# Altium schematic sheet CLK_HMC7043.SchDoc: Sayma RTM
size 420 x 297 mm; Author: G.Kasprowicz; CompanyName: WUT ISE; DrawnBy: G.Kasprowicz; Organization: WUT ISE; Address1: PW ISE; Address2: Nowowiejska 15/19 00-665 Warsaw; Address3: gkasprow@gmail.com; DocumentNumber: 5; Revision: 1.0; SheetNumber: 5; SheetTotal: 18; ModifiedBy: -; CheckedDate: -; Title2: HMC7043 clock distribution; DivGrp: WUT ISE; Designer: G.Kasprowicz; ModifiedDate: -; ProjectName: Sensor Box
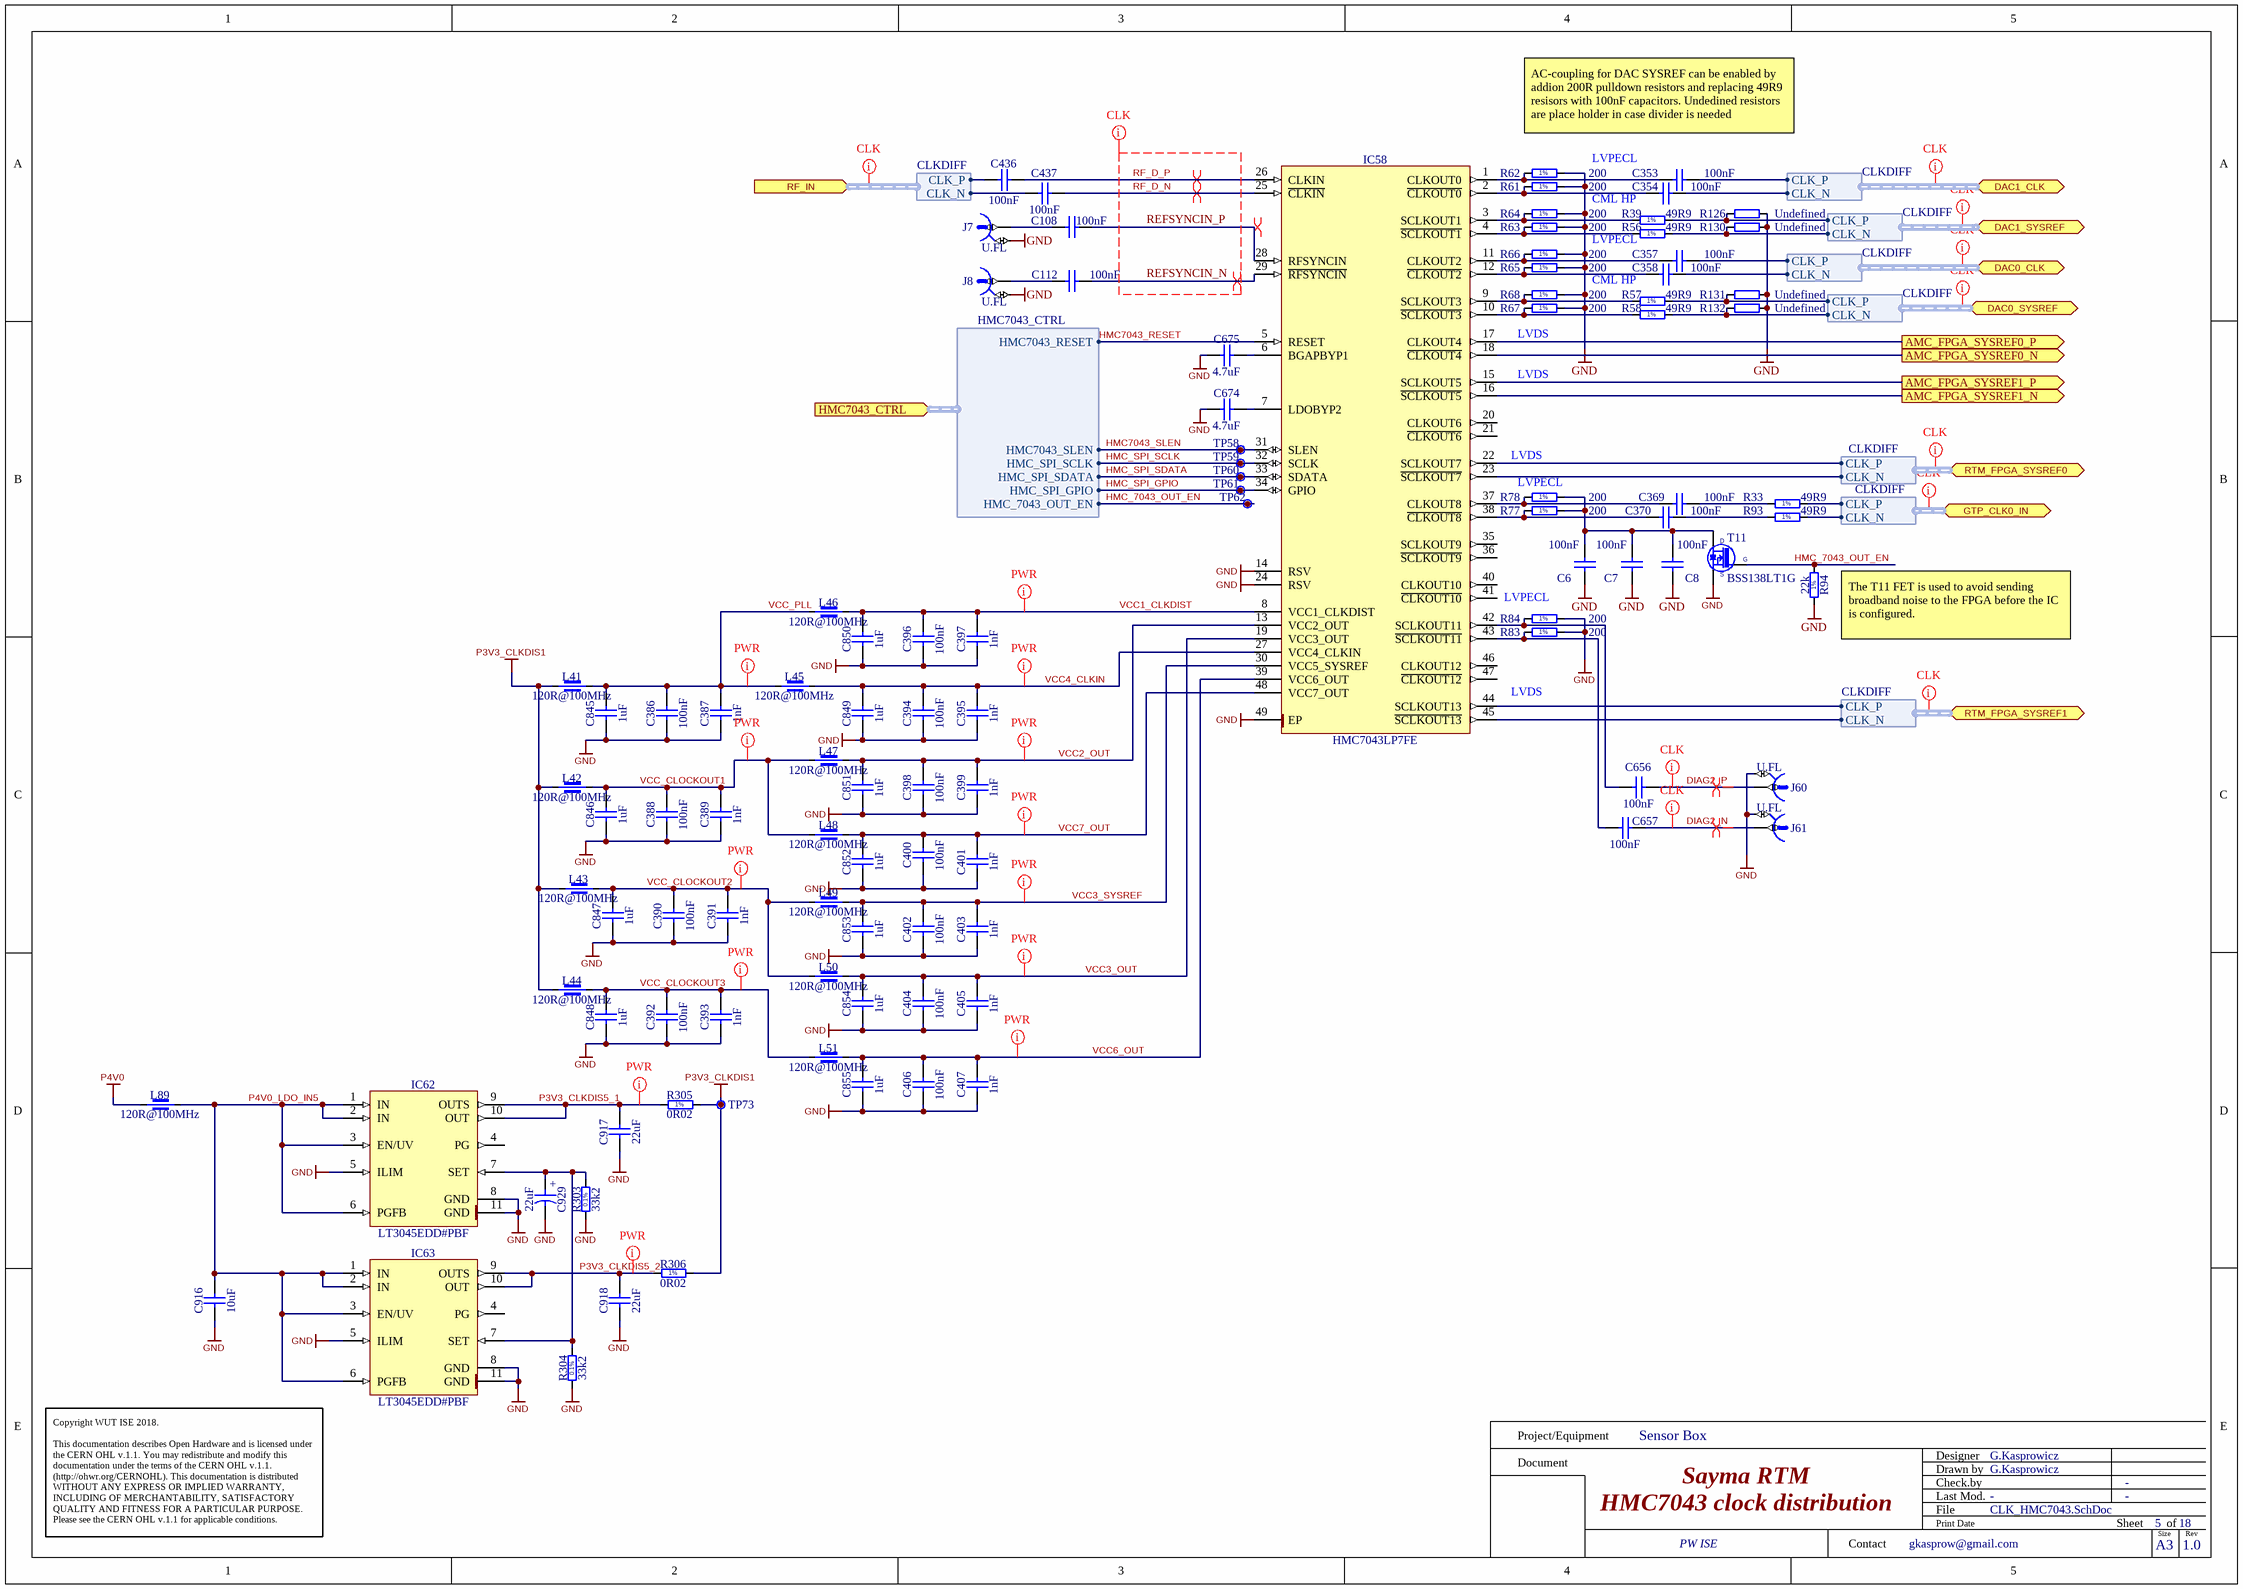
[diagram p0: CLK_HMC7043.SchDoc]

## Parts
C6  100nF  [CAPC0603X33N]
C7  100nF  [CAPC0603X33N]
C8  100nF  [CAPC0603X33N]
C108  100nF  [CAPC0603X33N]
C112  100nF  [CAPC0603X33N]
C353  100nF  [CAPC0603X33N]
C354  100nF  [CAPC0603X33N]
C357  100nF  [CAPC0603X33N]
C358  100nF  [CAPC0603X33N]
C369  100nF  [CAPC0603X33N]
C370  100nF  [CAPC0603X33N]
C386  100nF  [CAPC0603X33N]
C387  1nF  [CAPC0603X33N]
C388  100nF  [CAPC0603X33N]
C389  1nF  [CAPC0603X33N]
C390  100nF  [CAPC0603X33N]
C391  1nF  [CAPC0603X33N]
C392  100nF  [CAPC0603X33N]
C393  1nF  [CAPC0603X33N]
C394  100nF  [CAPC0603X33N]
C395  1nF  [CAPC0603X33N]
C396  100nF  [CAPC0603X33N]
C397  1nF  [CAPC0603X33N]
C398  100nF  [CAPC0603X33N]
C399  1nF  [CAPC0603X33N]
C400  100nF  [CAPC0603X33N]
C401  1nF  [CAPC0603X33N]
C402  100nF  [CAPC0603X33N]
C403  1nF  [CAPC0603X33N]
C404  100nF  [CAPC0603X33N]
C405  1nF  [CAPC0603X33N]
C406  100nF  [CAPC0603X33N]
C407  1nF  [CAPC0603X33N]
C436  100nF  [CAPC0603X33N]
C437  100nF  [CAPC0603X33N]
C656  100nF  [CAPC0603X33N]
C657  100nF  [CAPC0603X33N]
C674  4.7uF  [CAPC1608X90N]
C675  4.7uF  [CAPC1608X90N]
C845  1uF  [CAPC1005X55N]
C846  1uF  [CAPC1005X55N]
C847  1uF  [CAPC1005X55N]
C848  1uF  [CAPC1005X55N]
C849  1uF  [CAPC1005X55N]
C850  1uF  [CAPC1005X55N]
C851  1uF  [CAPC1005X55N]
C852  1uF  [CAPC1005X55N]
C853  1uF  [CAPC1005X55N]
C854  1uF  [CAPC1005X55N]
C855  1uF  [CAPC1005X55N]
C916  10uF  [CAPC1608X87N]
C917  22uF  [CAPC2012X135N]
C918  22uF  [CAPC2012X135N]
C929  22uF  [CAPMP3216X180N]
IC58  HMC7043LP7FE  [QFN50P700X700X100-49N-S565]
IC62  LT3045EDD#PBF  [SON50P300X300X80-11N-R175X248]
IC63  LT3045EDD#PBF  [SON50P300X300X80-11N-R175X248]
J7  U.FL  [HIROSE_U.FL-R-SMT-1(10)]
J8  U.FL  [HIROSE_U.FL-R-SMT-1(10)]
J60  U.FL  [HIROSE_U.FL-R-SMT-1(10)]
J61  U.FL  [HIROSE_U.FL-R-SMT-1(10)]
L41  120R@100MHz  [INDC1608X95N]
L42  120R@100MHz  [INDC1608X95N]
L43  120R@100MHz  [INDC1608X95N]
L44  120R@100MHz  [INDC1608X95N]
L45  120R@100MHz  [INDC1608X95N]
L46  120R@100MHz  [INDC1608X95N]
L47  120R@100MHz  [INDC1608X95N]
L48  120R@100MHz  [INDC1608X95N]
L49  120R@100MHz  [INDC1608X95N]
L50  120R@100MHz  [INDC1608X95N]
L51  120R@100MHz  [INDC1608X95N]
L89  120R@100MHz  [INDC1608X95N]
R33  49R9  [RESC1005X40N]
R39  49R9  [RESC1005X40N]
R56  49R9  [RESC1005X40N]
R57  49R9  [RESC1005X40N]
R58  49R9  [RESC1005X40N]
R61  200  [RESC1005X40N]
R62  200  [RESC1005X40N]
R63  200  [RESC1005X40N]
R64  200  [RESC1005X40N]
R65  200  [RESC1005X40N]
R66  200  [RESC1005X40N]
R67  200  [RESC1005X40N]
R68  200  [RESC1005X40N]
R77  200  [RESC1005X40N]
R78  200  [RESC1005X40N]
R83  200  [RESC1005X40N]
R84  200  [RESC1005X40N]
R93  49R9  [RESC1005X40N]
R94  22k  [RESC1005X40N]
R126  Undefined  [RESC1005X40N]
R130  Undefined  [RESC1005X40N]
R131  Undefined  [RESC1005X40N]
R132  Undefined  [RESC1005X40N]
R303  33k2  [RESC1608X55N]
R304  33k2  [RESC1608X55N]
R305  0R02  [RESC3216X80N]
R306  0R02  [RESC3216X80N]
T11  BSS138LT1G  [SOT95P240X110-3N]
TP58  Test Point  [TPS127]  (value not drawn)
TP59  Test Point  [TPS127]  (value not drawn)
TP60  Test Point  [TPS127]  (value not drawn)
TP61  Test Point  [TPS127]  (value not drawn)
TP62  Test Point  [TPS127]  (value not drawn)
TP73  Test Point  [TPS127]  (value not drawn)

## Ports
AMC_FPGA_SYSREF0_N (out), AMC_FPGA_SYSREF0_P (out), AMC_FPGA_SYSREF1_N (out), AMC_FPGA_SYSREF1_P (out), DAC0_CLK (bidir, harness CLKDIFF), DAC0_SYSREF (bidir, harness CLKDIFF), DAC1_CLK (bidir, harness CLKDIFF), DAC1_SYSREF (bidir, harness CLKDIFF), GTP_CLK0_IN (bidir, harness CLKDIFF), HMC7043_CTRL (in, harness HMC7043_CTRL), RF_IN (in, harness CLKDIFF), RTM_FPGA_SYSREF0 (bidir, harness CLKDIFF), RTM_FPGA_SYSREF1 (bidir, harness CLKDIFF)

## Harnesses
HMC7043_CTRL: HMC7043_RESET, HMC_SPI_SDATA, HMC7043_SLEN, HMC_SPI_SCLK, HMC_SPI_GPIO, HMC_7043_OUT_EN
CLKDIFF: CLK_P, CLK_N
CLKDIFF: CLK_N, CLK_P

## Nets
GND: C6.1 C7.1 C8.1 C386.1 C387.1 C388.1 C389.1 C390.1 C391.1 C392.1 C393.1 C394.1 C395.1 C396.1 C397.1 C398.1 C399.1 C400.1 C401.1 C402.1 C403.1 C404.1 C405.1 C406.1 C407.1 C674.1 C675.1 C845.2 C846.2 C847.2 C848.2 C849.2 C850.2 C851.2 C852.2 C853.2 C854.2 C855.2 C916.1 C917.1 C918.1 C929.2 IC58.14(RSV) IC58.24(RSV) IC58.49(EP) IC62.5(ILIM) IC62.8(GND) IC62.11(GND) IC63.5(ILIM) IC63.8(GND) IC63.11(GND) J7.2 J8.2 J60.2 J61.2 R61.2 R62.2 R63.2 R64.2 R65.2 R66.2 R67.2 R68.2 R83.2 R84.2 R94.1 R126.2 R130.2 R131.2 R132.2 R303.1 R304.1 T11.2(S)
P3V3_CLKDIS1: L41.1 L42.1 L43.1 L44.1 R305.2 R306.2 TP73.1
P4V0: L89.1
AMC_FPGA_SYSREF0_N: IC58.18(~{CLKOUT4}) ; port AMC_FPGA_SYSREF0_N
AMC_FPGA_SYSREF0_P: IC58.17(CLKOUT4) ; port AMC_FPGA_SYSREF0_P
AMC_FPGA_SYSREF1_N: IC58.16(~{SCLKOUT5}) ; port AMC_FPGA_SYSREF1_N
AMC_FPGA_SYSREF1_P: IC58.15(SCLKOUT5) ; port AMC_FPGA_SYSREF1_P
DIAG2_N: C657.2 J61.1
DIAG2_P: C656.2 J60.1
HMC7043_RESET: IC58.5(RESET) ; port HMC7043_CTRL.HMC7043_RESET
HMC7043_SLEN: IC58.31(SLEN) TP58.1 ; port HMC7043_CTRL.HMC7043_SLEN
HMC_7043_OUT_EN: R94.2 T11.1(G) TP62.1 ; port HMC7043_CTRL.HMC_7043_OUT_EN
HMC_SPI_GPIO: IC58.34(GPIO) TP61.1 ; port HMC7043_CTRL.HMC_SPI_GPIO
HMC_SPI_SCLK: IC58.32(SCLK) TP59.1 ; port HMC7043_CTRL.HMC_SPI_SCLK
HMC_SPI_SDATA: IC58.33(SDATA) TP60.1 ; port HMC7043_CTRL.HMC_SPI_SDATA
P3V3_CLKDIS5_1: C917.2 IC62.9(OUTS) IC62.10(OUT) R305.1
P3V3_CLKDIS5_2: C918.2 IC63.9(OUTS) IC63.10(OUT) R306.1
P4V0_LDO_IN5: C916.2 IC62.1(IN) IC62.2(IN) IC62.3(EN/UV) IC62.6(PGFB) IC63.1(IN) IC63.2(IN) IC63.3(EN/UV) IC63.6(PGFB) L89.2
REFSYNCIN_N: C112.2 IC58.29(~{RFSYNCIN})
REFSYNCIN_P: C108.2 IC58.28(RFSYNCIN)
RF_D_N: C437.2 IC58.25(~{CLKIN})
RF_D_P: C436.2 IC58.26(CLKIN)
VCC1_CLKDIST: C396.2 C397.2 C850.1 IC58.8(VCC1_CLKDIST) L46.2
VCC2_OUT: C398.2 C399.2 C851.1 IC58.13(VCC2_OUT) L47.2
VCC3_OUT: C404.2 C405.2 C854.1 IC58.19(VCC3_OUT) L50.2
VCC3_SYSREF: C402.2 C403.2 C853.1 IC58.30(VCC5_SYSREF) L49.2
VCC4_CLKIN: C394.2 C395.2 C849.1 IC58.27(VCC4_CLKIN) L45.2
VCC6_OUT: C406.2 C407.2 C855.1 IC58.39(VCC6_OUT) L51.2
VCC7_OUT: C400.2 C401.2 C852.1 IC58.48(VCC7_OUT) L48.2
VCC_CLOCKOUT1: C388.2 C389.2 C846.1 L42.2 L47.1 L48.1
VCC_CLOCKOUT2: C390.2 C391.2 C847.1 L43.2 L49.1 L50.1
VCC_CLOCKOUT3: C392.2 C393.2 C848.1 L44.2 L51.1
VCC_PLL: C386.2 C387.2 C845.1 L41.2 L45.1 L46.1
NetC6_2: C6.2 C7.2 C8.2 R77.2 R78.2 T11.3(D)
NetC108_1: C108.1 J7.1
NetC112_1: C112.1 J8.1
NetC353_1: C353.1 IC58.1(CLKOUT0) R62.1
NetC353_2: C353.2 ; port DAC1_CLK.CLK_P
NetC354_1: C354.1 IC58.2(~{CLKOUT0}) R61.1
NetC354_2: C354.2 ; port DAC1_CLK.CLK_N
NetC357_1: C357.1 IC58.11(CLKOUT2) R66.1
NetC357_2: C357.2 ; port DAC0_CLK.CLK_P
NetC358_1: C358.1 IC58.12(~{CLKOUT2}) R65.1
NetC358_2: C358.2 ; port DAC0_CLK.CLK_N
NetC369_1: C369.1 IC58.37(CLKOUT8) R78.1
NetC369_2: C369.2 R33.1
NetC370_1: C370.1 IC58.38(~{CLKOUT8}) R77.1
NetC370_2: C370.2 R93.1
NetC436_1: C436.1 ; port RF_IN.CLK_P
NetC437_1: C437.1 ; port RF_IN.CLK_N
NetC656_1: C656.1 IC58.42(SCLKOUT11) R84.1
NetC657_1: C657.1 IC58.43(~{SCLKOUT11}) R83.1
NetC674_2: C674.2 IC58.7(LDOBYP2)
NetC675_2: C675.2 IC58.6(BGAPBYP1)
NetC929_1: C929.1 IC62.7(SET) IC63.7(SET) R303.2 R304.2
NetIC58_3: IC58.3(SCLKOUT1) R39.1 R64.1
NetIC58_4: IC58.4(~{SCLKOUT1}) R56.1 R63.1
NetIC58_9: IC58.9(SCLKOUT3) R57.1 R68.1
NetIC58_10: IC58.10(~{SCLKOUT3}) R58.1 R67.1
NetIC58_22: IC58.22(SCLKOUT7) ; port RTM_FPGA_SYSREF0.CLK_P
NetIC58_23: IC58.23(~{SCLKOUT7}) ; port RTM_FPGA_SYSREF0.CLK_N
NetIC58_44: IC58.44(SCLKOUT13) ; port RTM_FPGA_SYSREF1.CLK_P
NetIC58_45: IC58.45(~{SCLKOUT13}) ; port RTM_FPGA_SYSREF1.CLK_N
NetR33_2: R33.2 ; port GTP_CLK0_IN.CLK_P
NetR39_2: R39.2 R126.1 ; port DAC1_SYSREF.CLK_P
NetR56_2: R56.2 R130.1 ; port DAC1_SYSREF.CLK_N
NetR57_2: R57.2 R131.1 ; port DAC0_SYSREF.CLK_P
NetR58_2: R58.2 R132.1 ; port DAC0_SYSREF.CLK_N
NetR93_2: R93.2 ; port GTP_CLK0_IN.CLK_N

Not connected (* = marked no-connect by the designer): IC58 20(CLKOUT6) 21(~{CLKOUT6}) 35(SCLKOUT9) 36(~{SCLKOUT9}) 40(CLKOUT10) 41(~{CLKOUT10}) 46(CLKOUT12) 47(~{CLKOUT12}); IC62 4(PG); IC63 4(PG)

## Layout directives
net class CLK: (no net found under the mark), DIAG2_N, DIAG2_P, REFSYNCIN_N, REFSYNCIN_P, RF_D_N, RF_D_P
differential pair: DIAG2_N, DIAG2_P, REFSYNCIN_N, REFSYNCIN_P, RF_D_N, RF_D_P
net class PWR: P3V3_CLKDIS5_1, P3V3_CLKDIS5_2, VCC1_CLKDIST, VCC2_OUT, VCC3_OUT, VCC3_SYSREF, VCC4_CLKIN, VCC6_OUT, VCC7_OUT, VCC_CLOCKOUT1, VCC_CLOCKOUT2, VCC_CLOCKOUT3, VCC_PLL

## Notes on the sheet
- AC-coupling for DAC SYSREF can be enabled by addion 200R pulldown resistors and replacing 49R9 resisors with 100nF capacitors. Undedined resistors are place holder in case divider is needed
- LVPECL
- CML HP
- LVDS
- (near R78) LVPECL
- (near R84) LVPECL
- (near R94) The T11 FET is used to avoid sending broadband noise to the FPGA before the IC is configured.
- Project/Equipment
- Document
- Designer
- Drawn by
- Check.by
- Copyright WUT ISE 2018.
  This documentation describes Open Hardware and is licensed under the CERN OHL v.1.1. You may redistribute and modify this documentation under the terms of the CERN OHL v.1.1. (http://ohwr.org/CERNOHL). This documentation is distributed WITHOUT ANY EXPRESS OR IMPLIED WARRANTY, INCLUDING OF MERCHANTABILITY, SATISFACTORY QUALITY AND FITNESS FOR A PARTICULAR PURPOSE. Please see the CERN OHL v.1.1 for applicable conditions.
- Contact
- File
- Last Mod.
- Print Date
- Sheet
- Size
- A3
- of
- Rev
- (in symbol CTE3216-18_22UF_6.3V_10%_LESR0900) +
- (in symbol R0402_22K_1%_0.0625W_100PPM) 1%
- (in symbol R0402_49R9_1%_0.0625W_100PPM) 1%
- (in symbol R0402_200R_1%_0.0625W_100PPM) 1%
- (in symbol R0603_33K2_0.1%_0.063W_10PPM) 0.1%
- (in symbol R1206_0R02_1%_0.5W_100PPM) 1%

## Library data of the parts
C6-C8 C108 C112 C353 C354 C357 C358 C369 C370 C386 C388 C390 C392 C394 C396 C398 C400 C402 C404 C406 C436 C437 C656 C657 = CC0201_100NF_6.3V_10%_X5R: Non-polarised capacitor; Manufacturer: GENERIC; Part Description: SMD Multilayer Chip Ceramic Capacitor; Manufacturer1 Part Number: 02016D104KAT2A; Tolerance: ±10%; Voltage: 6.3V; TC: X5R; Manufacturer Part Number: CC0201_100NF_6.3V_10%_X5R; Part Number: CC0201_100NF_6.3V_10%_X5R; Component Kind: Standard; Component Type: Standard; Pin Count: 2; Value: 100nF; Status: Not Recommended; Case: 0201; Mounted: Yes; Socket: No; SMD: Yes; Sense: No; Manufacturer1 Example: AVX; Manufacturer1 ComponentHeight: 0.33mm; HelpURL: \\cern.ch\dfs\Applications\Altium\Datasheets\CC0201_X5R_AVX.pdf; Author: CERN DEM JLC; CreateDate: 03.12.2007; LatestRevisionDate: 03.12.2007
C387 C389 C391 C393 C395 C397 C399 C401 C403 C405 C407 = CC0201_1NF_16V_10%_X5R: Non-polarised capacitor; Manufacturer: GENERIC; Part Description: SMD Multilayer Chip Ceramic Capacitor; Manufacturer1 Part Number: 0201YD102KAT2A; Tolerance: ±10%; Voltage: 16V; TC: X5R; Manufacturer Part Number: CC0201_1NF_16V_10%_X5R; Part Number: CC0201_1NF_16V_10%_X5R; Value: 1nF; Component Kind: Standard; Component Type: Standard; Pin Count: 2; Status: Not Recommended; Case: 0201; Mounted: Yes; Socket: No; SMD: Yes; Sense: No; Manufacturer1 Example: AVX; Manufacturer1 ComponentHeight: 0.33mm; HelpURL: \\cern.ch\dfs\Applications\Altium\Datasheets\CC0201_X5R_AVX.pdf; Author: CERN DEM JLC; CreateDate: 03.12.2007; LatestRevisionDate: 03.12.2007
C674 C675 = CC0603_4.7UF_25V_10%_X5R: Non-polarised capacitor; Manufacturer: GENERIC; Part Description: SMD Multilayer Chip Ceramic Capacitor; Manufacturer1 Part Number: GRM188R61E475KE11D; Tolerance: ±10%; Voltage: 25V; TC: X5R; Manufacturer Part Number: CC0603_4.7UF_25V_10%_X5R; Part Number: CC0603_4.7UF_25V_10%_X5R; Value: 4.7uF; Component Kind: Standard; Component Type: Standard; Pin Count: 2; Status: None; Case: 0603; Mounted: Yes; Socket: No; SMD: Yes; Sense: No; Manufacturer1 Example: MURATA; Manufacturer1 ComponentHeight: 0.95mm; HelpURL: \\cern.ch\dfs\Applications\Altium\Datasheets\CC0603_MURATA_GRM188R61E475KE11D.pdf; Author: CERN DEM JLC; CreateDate: 10.11.2014; LatestRevisionDate: 10.11.2014
C845-C855 = CC0402_1UF_16V_10%_X5R: Non-polarised capacitor; Manufacturer: GENERIC; Part Description: SMD Multilayer Chip Ceramic Capacitor; Manufacturer1 Part Number: C1005X5R1C105KT; Tolerance: ±10%; Voltage: 16V; TC: X5R; Manufacturer Part Number: CC0402_1UF_16V_10%_X5R; Part Number: CC0402_1UF_16V_10%_X5R; Value: 1uF; Component Kind: Standard; Component Type: Standard; Pin Count: 2; Status: Preferred; Case: 0402; Mounted: Yes; Socket: No; SMD: Yes; Sense: No; Manufacturer1 Example: TDK; Manufacturer1 ComponentHeight: 0.55mm; HelpURL: \\cern.ch\dfs\Applications\Altium\Datasheets\CC0402_X5R_TDK_C.pdf; Author: CERN DEM JLC; CreateDate: 25.10.2012; LatestRevisionDate: 25.10.2012
C916 = CC0603_10uF_6.3V_20%_X5R: Non-polarised capacitor; Manufacturer: GENERIC; Part Description: SMD Multilayer Chip Ceramic Capacitor; Manufacturer1 Part Number: C0603C106M9PAC; Tolerance: ±20%; Voltage: 6.3V; TC: X5R; Manufacturer Part Number: CC0603_10uF_6.3V_20%_X5R; Part Number: CC0603_10UF_6.3V_20%_X5R; Value: 10uF; Component Kind: Standard; Component Type: Standard; Pin Count: 2; Status: Preferred; Case: 0603; Mounted: Yes; Socket: No; SMD: Yes; Sense: No; Manufacturer1 Example: KEMET; Manufacturer1 ComponentHeight: 0.95mm; HelpURL: \\cern.ch\dfs\Applications\Altium\Datasheets\CC0603_X5R_KEMET.pdf; Author: CERN DEM JLC; CreateDate: 03.12.2007; LatestRevisionDate: 03.12.2007
C917 C918 = CC0805_22UF_16V_10%_X5R: Non-polarised capacitor; Manufacturer: GENERIC; Part Description: SMD Multilayer Chip Ceramic Capacitor; Manufacturer1 Part Number: C2012X5R1C226KT; Tolerance: ±10%; Voltage: 16V; TC: X5R; Manufacturer Part Number: CC0805_22UF_16V_10%_X5R; Part Number: CC0805_22UF_16V_10%_X5R; Value: 22uF; Component Kind: Standard; Component Type: Standard; Pin Count: 2; Status: Preferred; Case: 0805; Mounted: Yes; Socket: No; SMD: Yes; Sense: No; Manufacturer1 Example: TDK; Manufacturer1 ComponentHeight: 1.35mm; HelpURL: \\cern.ch\dfs\Applications\Altium\Datasheets\CC0805_X5R_TDK_C.pdf; Author: CERN DEM JLC; CreateDate: 25.10.2012; LatestRevisionDate: 25.10.2012
C929 = CTE3216-18_22UF_6.3V_10%_LESR0900: Polarised capacitor; Manufacturer: GENERIC; Part Description: Low ESR 0R9 Solid Tantalum Chip Capacitor; Manufacturer1 Part Number: TPSA226K006R0900; Tolerance: ±10%; Voltage: 6.3V; Manufacturer Part Number: CTE3216-18_22UF_6.3V_10%_LESR0900; Part Number: CTE3216-18_22UF_6.3V_10%_LESR0900; Value: 22uF; Component Kind: Standard; Component Type: Standard; Pin Count: 2; Status: Preferred; Case: A; Mounted: Yes; Socket: No; SMD: Yes; Sense: No; Manufacturer1 Example: AVX; Manufacturer1 ComponentHeight: 1.8mm; HelpURL: \\cern.ch\dfs\Applications\Altium\Datasheets\CTE-LESR_AVX_TPS.pdf; Author: CERN DEM JLC; CreateDate: 05.05.2008; LatestRevisionDate: 20.01.2009
IC58 = HMC7043LP7FE: High Performance, 3.2 GHz, 14-Output Fanout Buffer; Manufacturer: ANALOG DEVICES; PressFit: No; Bonding: No; Manufacturer Part Number: HMC7043LP7FE; PackageDescription: QFN, 0.50mm Pitch, Square; 48 Pin, 7.00mm L X 7.00mm W X 1.00mm H Body (w/thermal Tab 5.65mm X 5.65mm), IPC Medium Density; Part Description: High Performance, 3.2GHz, 14-Output Fanout Buffer; Part Number: HMC7043LP7FE; Component Kind: Standard; Component Type: Standard; Device: HMC7043LP7FE; Pin Count: 49; Case: QFN48; Mounted: Yes; Socket: No; SMD: Yes; Sense: No; ComponentHeight: 0.9mm; Author: CERN DEM BC; HelpURL: \\cern.ch\dfs\Applications\Altium\Datasheets\HMC7043LP7FE.pdf; CreateDate: 15.08.2016; LatestRevisionDate: 15.08.2016
IC62 IC63 = LT3045EDD#PBF: 20V, 500mA, Ultralow Noise, Ultrahigh PSRR Linear Regulator; Manufacturer: LINEAR TECHNOLOGY; PressFit: No; Bonding: No; Manufacturer Part Number: LT3045EDD#PBF; PackageDescription: SON, 0.50mm Pitch, 10-pin, 3.00mm W  X 3.00mm L X 0.80mm Height, (w/thermal tab 1.75 X 2.48 mm), IPC Medium Density; Part Description: 20V, 500mA, Ultralow Noise, Ultrahigh PSRR Linear Regulator; Part Number: LT3045EDD#PBF; Component Kind: Standard; Component Type: Standard; Device: LT3045EDD#PBF; Pin Count: 11; Case: SON10; Mounted: Yes; Socket: No; SMD: Yes; Sense: No; ComponentHeight: 0.8mm; HelpURL: \\cern.ch\dfs\Applications\Altium\Datasheets\LT3045EDD#PBF.pdf; Author: CERN DEM JLC; CreateDate: 07.12.2016; LatestRevisionDate: 07.12.2016
J7 J8 J60 J61 = HIROSE_U.FL-R-SMT-1(10): Manufacturer: HIROSE (HRS); Part Description: Up to 6GHz Ultra Small Surface Mount Male Coaxial Connectors U.FL Series; PressFit: No; Manufacturer Part Number: U.FL-R-SMT-1(10); Part Number: HIROSE_U.FL-R-SMT-1(10); Component Kind: Standard; Component Type: Standard; Pin Count: 2; Family: U.FL; Mounted: Yes; Socket: No; SMD: Yes; Sense: No; Status: None; ComponentHeight: 1.25mm; HelpURL: \\cern.ch\dfs\Applications\Altium\Datasheets\HIROSE_U.FL-R-SMT-1(10).pdf; Author: CERN DEM JLC; CreateDate: 24.03.2010; LatestRevisionDate: 24.03.2010
L41-L51 L89 = IND0603_MURATA_BLM18PG121SN1D: Manufacturer: MURATA; Part Description: SMD EMIFIL Chip Ferrite Bead; Power: 2A; Resistance: 0.05R; Manufacturer Part Number: BLM18PG121SN1D; Part Number: IND0603_MURATA_BLM18PG121SN1D; Value: 120R@100MHz; Component Kind: Standard; Component Type: Standard; Pin Count: 2; Status: None; Case: 0603; Mounted: Yes; Socket: No; SMD: Yes; Sense: No; ComponentHeight: 0.95mm; HelpURL: \\cern.ch\dfs\Applications\Altium\Datasheets\IND0603_MURATA_BLM18P.pdf; Author: CERN DEM BC; CreateDate: 27.07.2015; LatestRevisionDate: 25.10.2018
R33 R39 R56-R58 R93 = R0402_49R9_1%_0.0625W_100PPM: Resistor - 1%; Manufacturer: GENERIC; Manufacturer1 Part Number: 232270674999L or RC0402FR-0749R9L; Part Description: General Purpose Thick Film Chip Resistor; TC: ±100ppm/°C; PressFit: No; Case: 0402; Manufacturer Part Number: R0402_49R9_1%_0.0625W_100PPM; Manufacturer1 ComponentHeight: 0.4mm; Manufacturer1 Example: YAGEO PHYCOMP; Part Number: R0402_49R9_1%_0.0625W_100PPM; Pin Count: 2; Power: 0.0625W; Sense: No; SMD: Yes; Status: Not Recommended; Tolerance: ±1%; Value: 49R9; Component Kind: Standard; Component Type: Standard; Mounted: Yes; Socket: No; HelpURL: \\cern.ch\dfs\Applications\Altium\Datasheets\R0402_Phycomp_RC0402.pdf; Author: CERN DEM JLC; CreateDate: 24.10.2012; LatestRevisionDate: 24.10.2012
R61-R68 R77 R78 R83 R84 = R0402_200R_1%_0.0625W_100PPM: Resistor - 1%; Manufacturer: GENERIC; Part Description: General Purpose Thick Film Chip Resistor; Manufacturer1 Part Number: 232270672001L; TC: ±100ppm/°C; PressFit: No; Manufacturer Part Number: R0402_200R_1%_0.0625W_100PPM; Part Number: R0402_200R_1%_0.0625W_100PPM; Tolerance: ±1%; Value: 200; Component Kind: Standard; Component Type: Standard; Pin Count: 2; Status: Not Recommended; Power: 0.0625W; Case: 0402; Mounted: Yes; Sense: No; Socket: No; SMD: Yes; Manufacturer1 Example: YAGEO PHYCOMP; Manufacturer1 ComponentHeight: 0.4mm; HelpURL: \\cern.ch\dfs\Applications\Altium\Datasheets\R0402_Phycomp_RC0402.pdf; Author: CERN DEM JLC; CreateDate: 03.12.2007; LatestRevisionDate: 17.10.2012
R94 = R0402_22K_1%_0.0625W_100PPM: Resistor - 1%; Manufacturer: GENERIC; Manufacturer1 Part Number: 232270672203L; Part Description: General Purpose Thick Film Chip Resistor; TC: ±100ppm/°C; PressFit: No; Case: 0402; Manufacturer Part Number: R0402_22K_1%_0.0625W_100PPM; Manufacturer1 ComponentHeight: 0.4mm; Manufacturer1 Example: YAGEO PHYCOMP; Part Number: R0402_22K_1%_0.0625W_100PPM; Pin Count: 2; Power: 0.0625W; Sense: No; SMD: Yes; Status: Not Recommended; Tolerance: ±1%; Value: 22k; Component Kind: Standard; Component Type: Standard; Mounted: Yes; Socket: No; HelpURL: \\cern.ch\dfs\Applications\Altium\Datasheets\R0402_Phycomp_RC0402.pdf; Author: CERN DEM JLC; CreateDate: 03.12.2007; LatestRevisionDate: 17.10.2012
R126 R130-R132 = R0402_NO-VALUE: Resistor; Part Description: Reserved Footprint For a 0402 (1005) Chip Resistor; PressFit: No; Mounted: No; Part Number: R0402_NO-VALUE; Component Kind: Standard; Component Type: Standard; Pin Count: 2; Value: Undefined; Status: None; Manufacturer: Undefined; Manufacturer Part Number: R0402_NO-VALUE; Case: 0402; Sense: No; Socket: No; SMD: Yes; Manufacturer1 Example: Undefined; Manufacturer1 Part Number: Undefined; Manufacturer1 ComponentHeight: Undefined; HelpURL: Undefined; Author: CERN DEM JLC; CreateDate: 03.12.2007; LatestRevisionDate: 13.03.2008
R303 R304 = R0603_33K2_0.1%_0.063W_10PPM: Resistor - 0.1%; Manufacturer: GENERIC; Part Description: Thin Film Chip Resistor; Manufacturer1 Part Number: RN73C1J33K2BTDF; Power: 0.063W; TC: ±10ppm; PressFit: No; Manufacturer Part Number: R0603_33K2_0.1%_0.063W_10PPM; Part Number: R0603_33K2_0.1%_0.063W_10PPM; Tolerance: ±0.1%; Value: 33k2; Component Kind: Standard; Component Type: Standard; Pin Count: 2; Status: Not Recommended; Case: 0603; Mounted: Yes; Sense: No; Socket: No; SMD: Yes; Manufacturer1 Example: TYCO HOLSWORTHY; Manufacturer1 ComponentHeight: 0.5mm; HelpURL: \\cern.ch\dfs\Applications\Altium\Datasheets\R0603_Tyco_RN73.pdf; Author: CERN DEM JLC; CreateDate: 03.12.2007; LatestRevisionDate: 13.03.2008
R305 R306 = R1206_0R02_1%_0.5W_100PPM: Resistor - 1%; Manufacturer Part Number: LRF1206-R020FI; Manufacturer: TT Electronics; Part Description: Low Value Flat Chip Resistor; Power: 0.5W; TC: ±100ppm/°C; PressFit: No; Part Number: R1206_0R02_1%_0.5W_100PPM; Tolerance: ±1%; Value: 0R02; Component Kind: Standard; Component Type: Standard; Pin Count: 2; Status: None; Case: 1206; Mounted: Yes; Sense: No; Socket: No; SMD: Yes; ComponentHeight: 0.8mm; HelpURL: \\cern.ch\dfs\Applications\Altium\Datasheets\R1206_WELWYN_LRF.pdf; Author: CERN DEM JLC; CreateDate: 11.05.2010; LatestRevisionDate: 03.09.2012
T11 = BSS138LT1G: N-CHANNEL MOSFET WITH DIODE; Manufacturer: ON SEMICONDUCTOR; Part Description: 50V 200mA N-Channel Enhancement Mode Field-Effect Transistor; Bonding: No; PressFit: No; Case: SOT23-3; ComponentHeight: 1.11mm; Device: BSS138LT1G; Manufacturer Part Number: BSS138LT1G; Mounted: Yes; PackageDescription: SOT23 3-Leads, Pitch 0.95mm - Body 1.4x3mm, IPC Medium Density; Part Number: BSS138LT1G; Pin Count: 3; Sense: No; SMD: Yes; Socket: No; Component Kind: Standard; Component Type: Standard; HelpURL: \\cern.ch\dfs\Applications\Altium\Datasheets\BSS138LT1G.pdf; Author: CERN DEM JLC; CreateDate: 23.03.2009; LatestRevisionDate: 23.03.2009
TP58-TP62 TP73 = SMD_PAD_1.27X1.27MM: Part Description: 1.27mm x 1.27mm PCB Copper Area (SMD Test Point); Mounted: No; ComponentHeight: 0mm; Family: Test Point; Part Number: SMD_PAD_1.27X1.27MM; Pin Count: 1; Sense: No; SMD: Yes; Socket: No; Status: None; Component Kind: Standard (No BOM); Component Type: Standard (No BOM); HelpURL: Undefined; Author: CERN DEM JLC; CreateDate: 12.01.2008; LatestRevisionDate: 12.01.2008; PackageDescription: 1.27mm x 1.27mm PCB Copper Area (SMD Test Point)